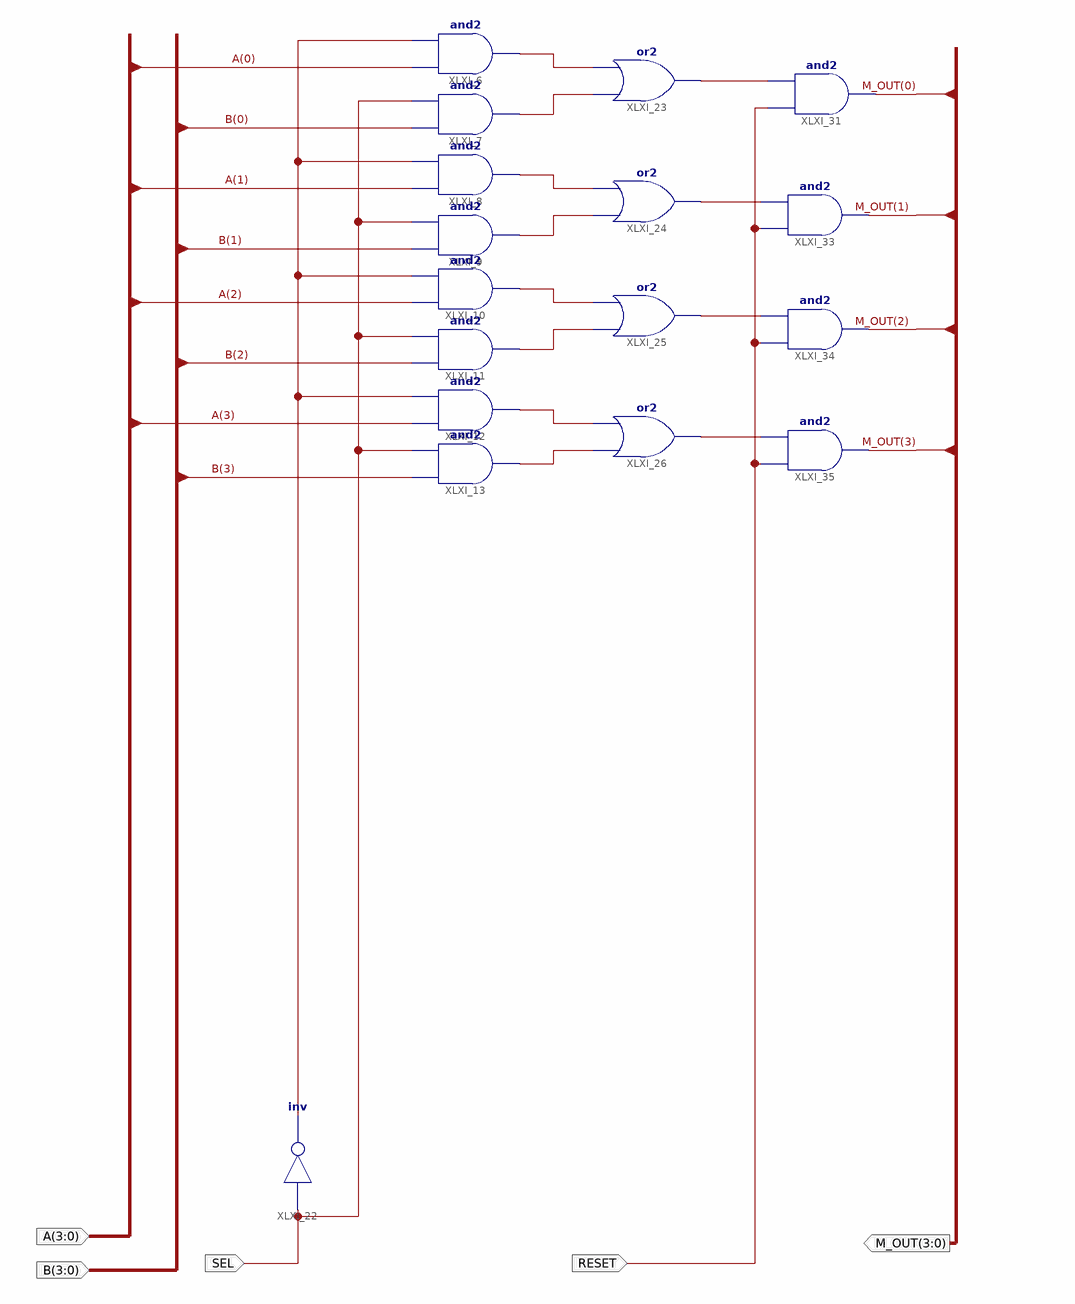
[diagram p0: schematic sheet 1]
// Xilinx ISE schematic Two_to_One_MUX_Four_Bit.sch (spartan6) as structural Verilog: 17 symbols, 5 ports
module Two_to_One_MUX_Four_Bit (
  input  SEL,
  input  [3:0] A,
  input  [3:0] B,
  input  RESET,
  output [3:0] M_OUT
);

  wire XLXN_4, XLXN_9, XLXN_10, XLXN_11, XLXN_12, XLXN_13, XLXN_14, XLXN_15, XLXN_16, XLXN_57, XLXN_58,
       XLXN_59, XLXN_60;

  and XLXI_6 (XLXN_9, A[0], XLXN_4);
  and XLXI_7 (XLXN_10, B[0], SEL);
  and XLXI_8 (XLXN_11, A[1], XLXN_4);
  and XLXI_9 (XLXN_12, B[1], SEL);
  and XLXI_10 (XLXN_13, A[2], XLXN_4);
  and XLXI_11 (XLXN_14, B[2], SEL);
  and XLXI_12 (XLXN_15, A[3], XLXN_4);
  and XLXI_13 (XLXN_16, B[3], SEL);
  or XLXI_23 (XLXN_57, XLXN_10, XLXN_9);
  or XLXI_24 (XLXN_58, XLXN_12, XLXN_11);
  or XLXI_25 (XLXN_59, XLXN_14, XLXN_13);
  or XLXI_26 (XLXN_60, XLXN_16, XLXN_15);
  and XLXI_31 (M_OUT[0], RESET, XLXN_57);
  and XLXI_33 (M_OUT[1], RESET, XLXN_58);
  and XLXI_34 (M_OUT[2], RESET, XLXN_59);
  and XLXI_35 (M_OUT[3], RESET, XLXN_60);
  not XLXI_22 (XLXN_4, SEL);
endmodule
